# EAGLE schematic canAIReSensor (EAGLE 6.4)
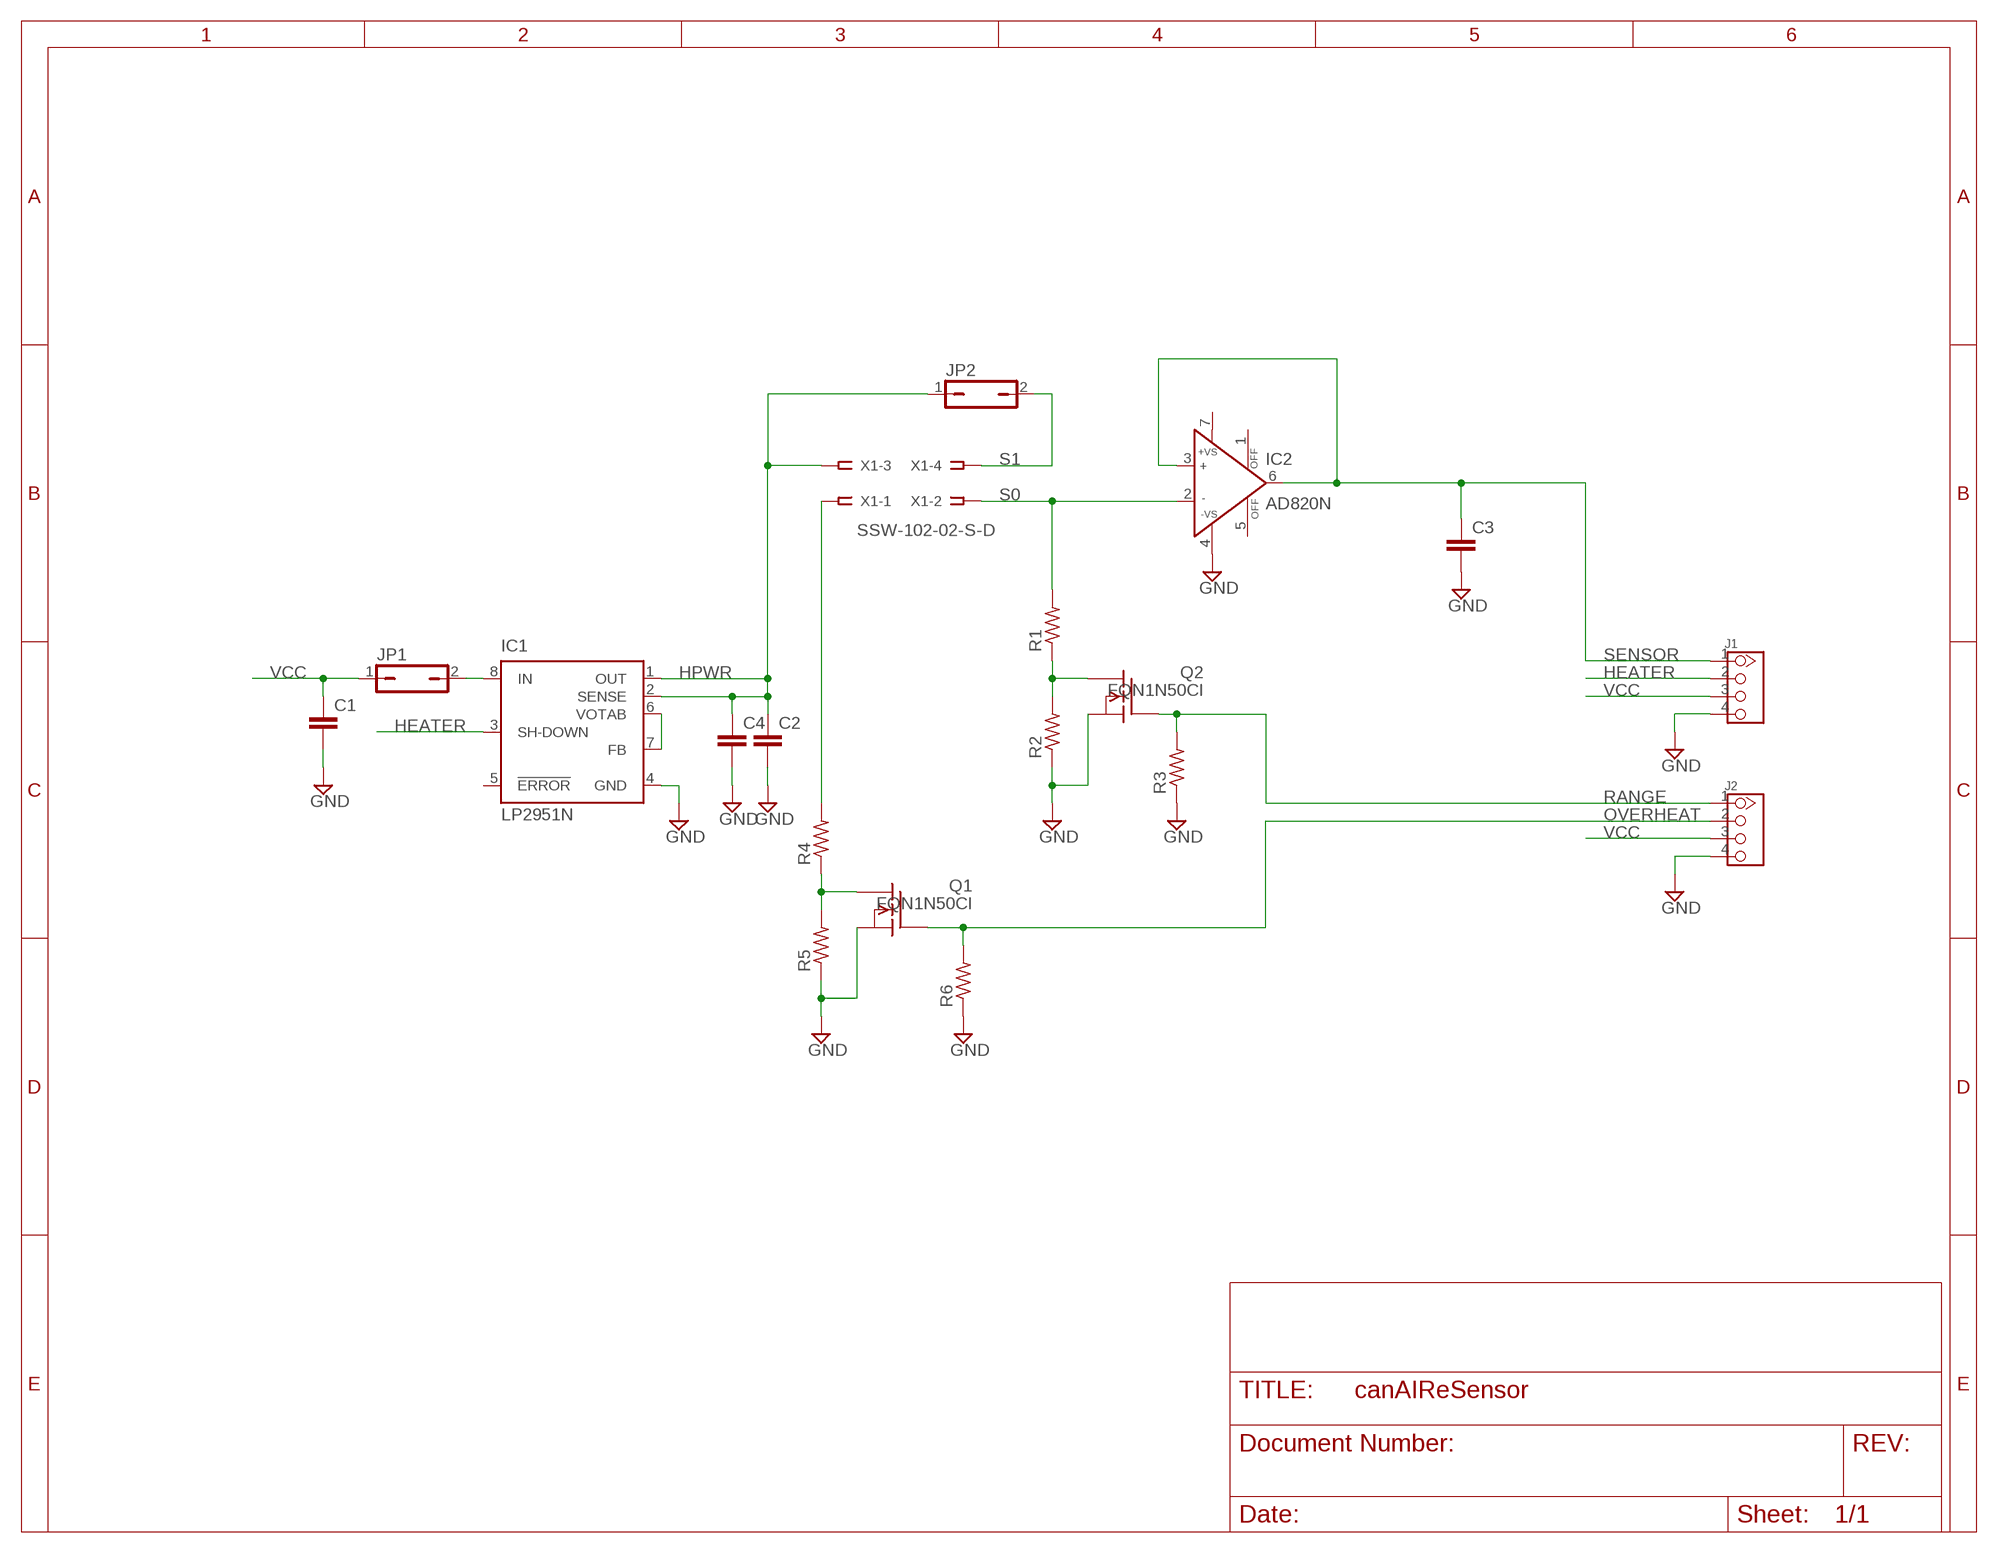
[diagram p0: schematic, sheet 1]

## Parts
C1  C-EU050-024X044  [C050-024X044]
C2  C-EU050-024X044  [C050-024X044]
C3  C-EU050-024X044  [C050-024X044]
C4  C-EU050-024X044  [C050-024X044]
IC1  LP2951N  [DIL08]
IC2  AD820N  [DIL08]
J1  TWIG-4P-2.0'90D'  [4P-2.0-90D]
J2  TWIG-4P-2.0'90D'  [4P-2.0-90D]
JP1  JP1Q  [JP1]
JP2  JP1Q  [JP1]
Q1  FQN1N50CI  [TO92-INLINE]
Q2  FQN1N50CI  [TO92-INLINE]
R1  R-US_0207/10  [0207/10]
R2  R-US_0207/10  [0207/10]
R3  R-US_0207/10  [0207/10]
R4  R-US_0207/10  [0207/10]
R5  R-US_0207/10  [0207/10]
R6  R-US_0207/10  [0207/10]
X1  SSW-102-02-S-D  [SSW-102-02-S-D]

## Nets
GND: C1.2 C2.2 C3.2 C4.2 IC1.4(GND) IC2.4(-VS) J1.4 J2.4 Q1.3(S) Q2.3(S) R2.1 R3.1 R5.1 R6.1
HEATER: IC1.3(SH-DOWN) J1.2
HPWR: C2.1 C4.1 IC1.1(OUT) IC1.2(SENSE) JP2.1 X1.3
N$1: Q2.1(D) R1.1 R2.2
N$2: R4.2 X1.1
N$4: IC1.6(VOTAB) IC1.7(FB)
N$6: Q1.1(D) R4.1 R5.2
OVERHEAT: J2.2 Q1.2(G) R6.2
RANGE: J2.1 Q2.2(G) R3.2
S0: IC2.2(IN-) R1.2 X1.2
S1: JP2.2 X1.4
SENSOR: C3.1 IC2.3(IN+) IC2.6(OUT) J1.1
VCC: C1.1 J1.3 J2.3 JP1.1
VIN: IC1.8(IN) JP1.2
Unconnected: IC1.5(!ERROR) IC2.1(OFF) IC2.5(OFF) IC2.7(+VS)

## Library data of the parts
C1-C4 = rcl:C-EU: CAPACITOR, European symbol
IC1 = linear:LP2951: 100 mA, Low Power Low Dropout Voltage Regulator Source: http://www.onsemi.com/pub/Collateral/LP2950-D.PDF
IC2 = analog-devices:AD820N: Single-Supply, Rail-to-Rail, Low Power, FET Input Op Amp Source: http://www.analog.com/static/imported-files/data_sheets/AD820.pdf; OC_FARNELL: 1438579; OC_NEWARK: unknown
J1 J2 = Connector:TWIG-4P-2.0
JP1 JP2 = jumper:JP1Q: JUMPER
Q1 Q2 = adafruit:FQN1N50C: N-Channel Enhancement MOSFET 500V, 0.4A, 6.0 Ohm
R1-R6 = rcl:R-US_: RESISTOR, American symbol
X1 = con-samtec:SSW-102-02-S-D: THROUGH-HOLE .025" SQ POST SOCKET Source: Samtec SSW.pdf; MPN: SSW-102-02-S-D; OC_FARNELL: unknown; OC_NEWARK: 11P9349